# EAGLE design miniKame (EAGLE 7.4.0)
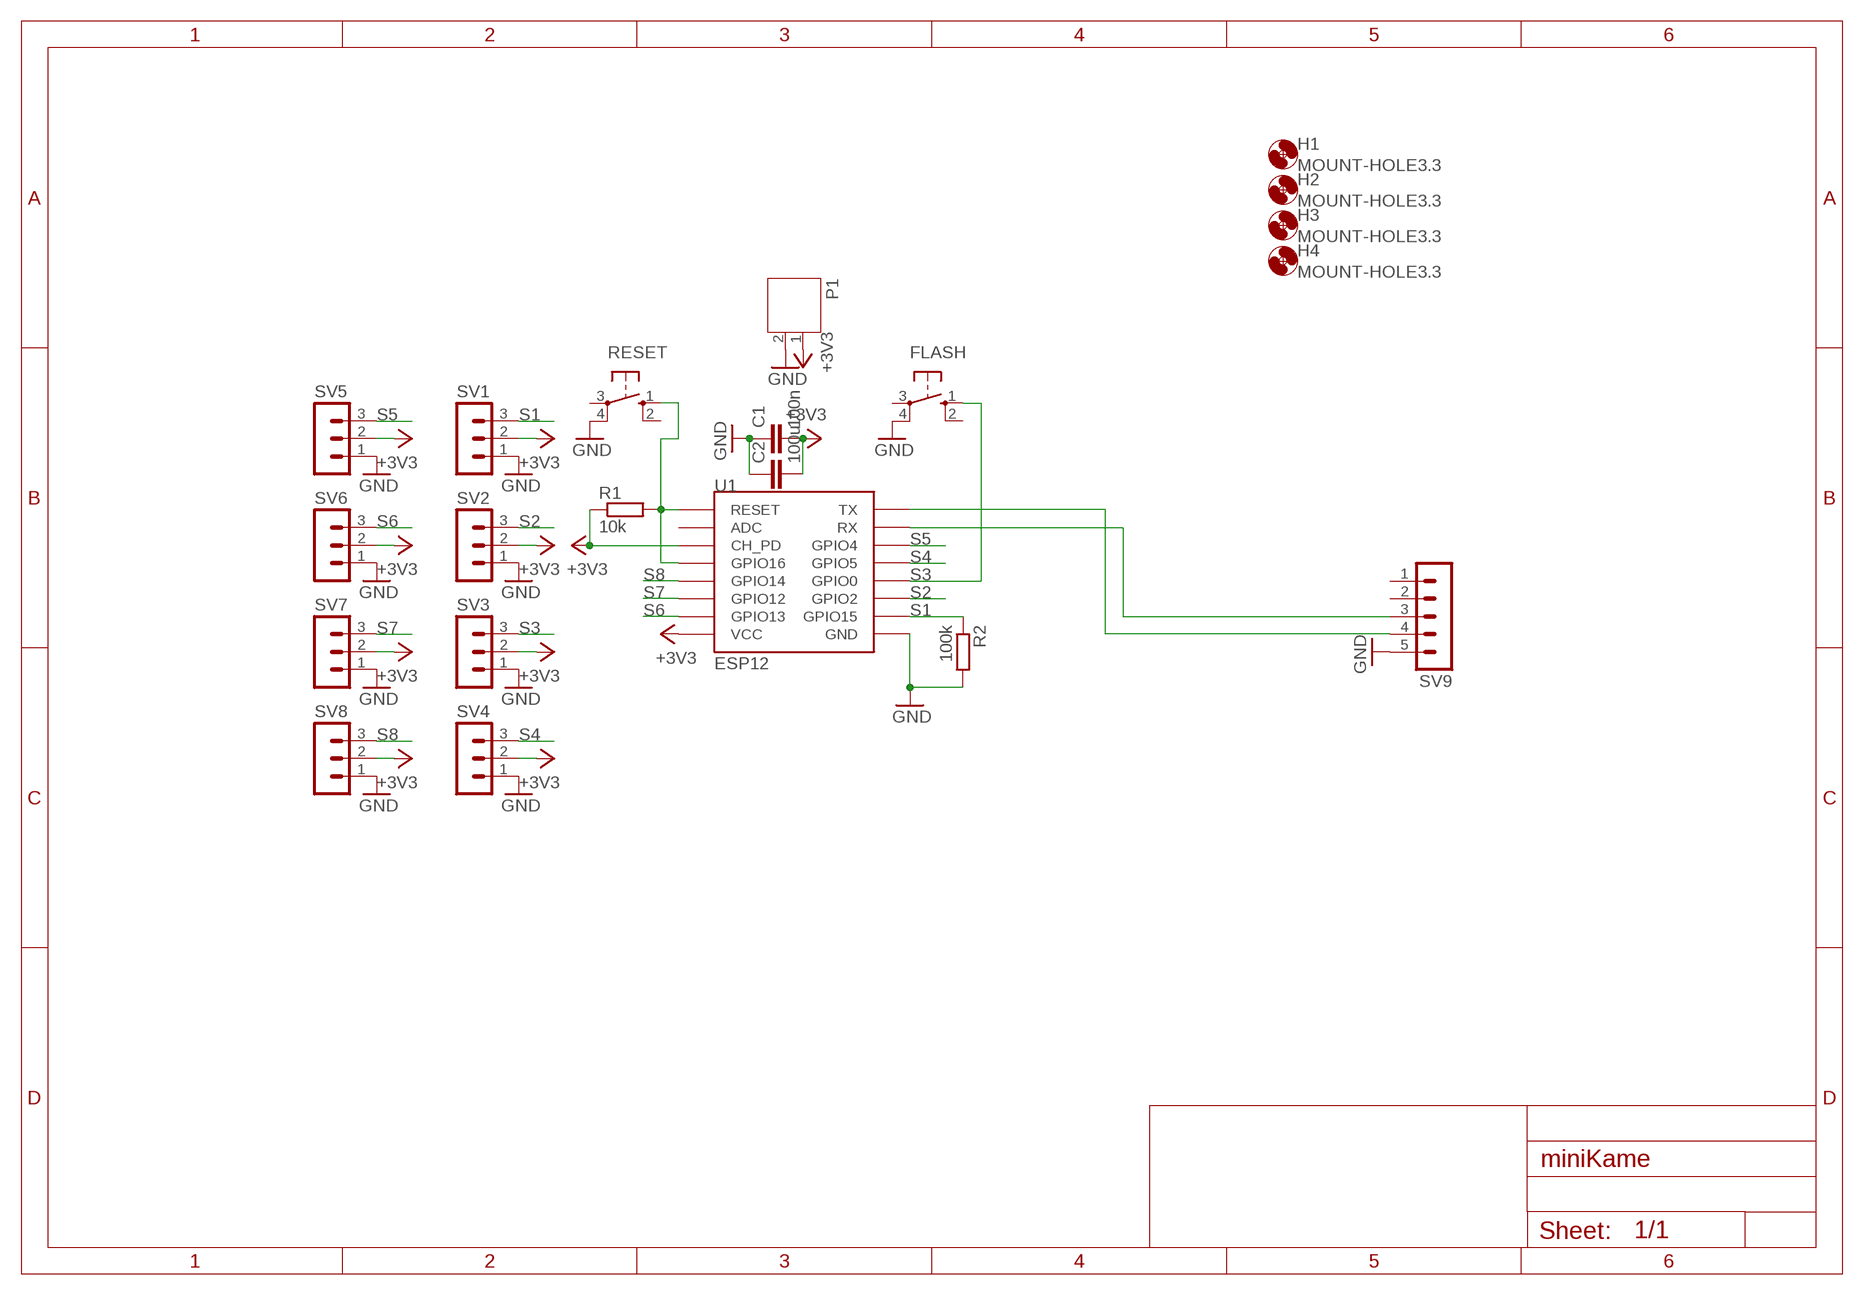
[diagram p0: schematic, sheet 1]

## Parts
C1  100n  C-EUC0805  [C0805]
C2  100u  C-EUC0805  [C0805]
FLASH  10-XX  [B3F-10XX]
H1  MOUNT-HOLE3.3  [3,3]
H2  MOUNT-HOLE3.3  [3,3]
H3  MOUNT-HOLE3.3  [3,3]
H4  MOUNT-HOLE3.3  [3,3]
P1  JST-PH2  [JST-PH2]
R1  10k  R-EU_M0805  [M0805]
R2  100k  R-EU_M0805  [M0805]
RESET  10-XX  [B3F-10XX]
SV1  MA03-1  [MA03-1]
SV2  MA03-1  [MA03-1]
SV3  MA03-1  [MA03-1]
SV4  MA03-1  [MA03-1]
SV5  MA03-1  [MA03-1]
SV6  MA03-1  [MA03-1]
SV7  MA03-1  [MA03-1]
SV8  MA03-1  [MA03-1]
SV9  MA05-1  [MA05-1]
U1  ESP12  [ESP12]

## Nets
+3V3: C1.2 C2.2 P1.1 R1.1 SV1.2 SV2.2 SV3.2 SV4.2 SV5.2 SV6.2 SV7.2 SV8.2 U1.CH_PD U1.VCC
GND: C1.1 C2.1 FLASH.4(P1) P1.2 R2.2 RESET.4(P1) SV1.1 SV2.1 SV3.1 SV4.1 SV5.1 SV6.1 SV7.1 SV8.1 SV9.5 U1.GND
N$1: SV9.4 U1.TX
N$2: SV9.3 U1.RX
N$4: R1.2 RESET.1(S) U1.GPIO16 U1.RESET
S1: R2.1 SV1.3 U1.GPIO15
S2: SV2.3 U1.GPIO2
S3: FLASH.1(S) SV3.3 U1.GPIO0
S4: SV4.3 U1.GPIO5
S5: SV5.3 U1.GPIO4
S6: SV6.3 U1.GPIO13
S7: SV7.3 U1.GPIO12
S8: SV8.3 U1.GPIO14
Unconnected: FLASH.2(S1) FLASH.3(P) RESET.2(S1) RESET.3(P) SV9.1 SV9.2 U1.ADC

## Library data of the parts
C1 C2 = resistor:C-EU: CAPACITOR, European symbol
FLASH RESET = switch-omron:10-XX: OMRON SWITCH; MPN: B3F-1000; OC_FARNELL: 176432; OC_NEWARK: 36M3542
H1-H4 = holes:MOUNT-HOLE: MOUNTING HOLE with drill center marker
P1 = jst-ph:JST-PH2
R1 R2 = resistor:R-EU_: RESISTOR, European symbol
SV1-SV8 = con-lstb:MA03-1: PIN HEADER; OC_FARNELL: unknown; OC_NEWARK: unknown
SV9 = con-lstb:MA05-1: PIN HEADER; OC_FARNELL: unknown; OC_NEWARK: unknown
U1 = esp8266modules:ESP12: ESP8266 Wifi module 12

## Board
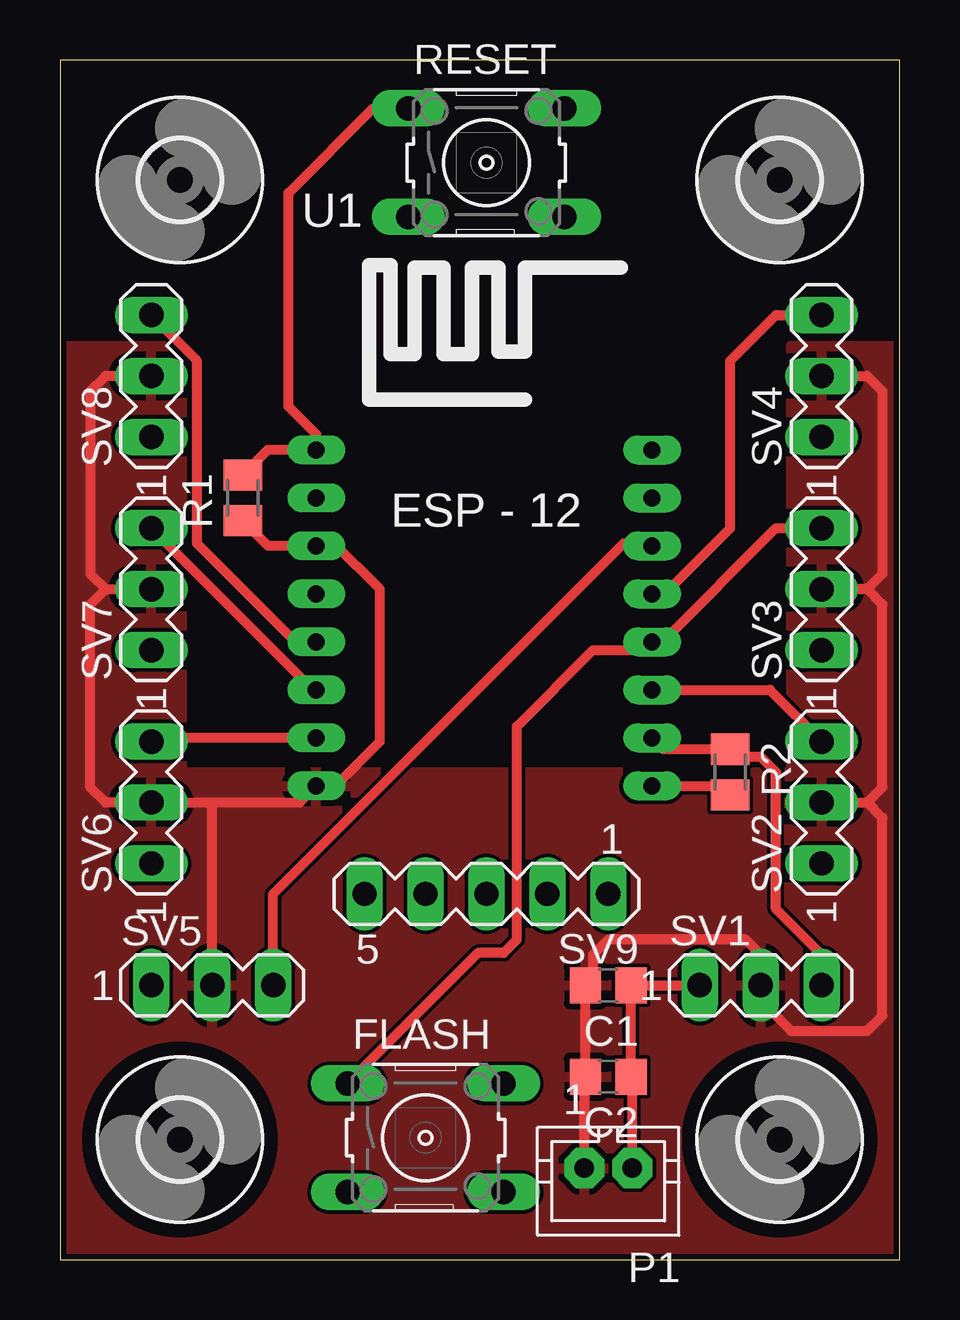
[diagram p1: board, top side]
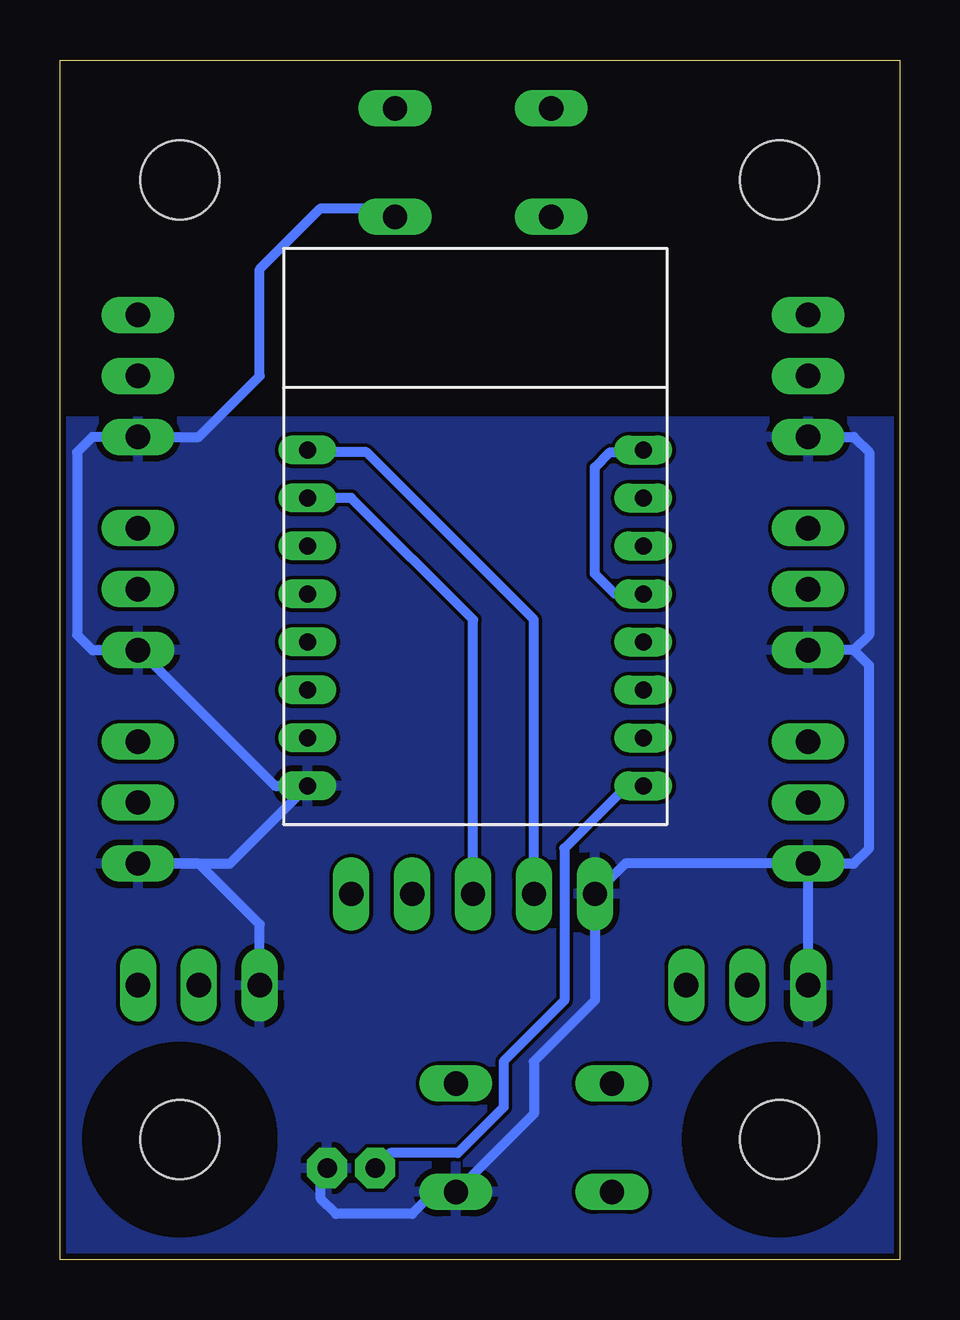
[diagram p2: board, bottom side, seen from below]

Size 35 x 50 mm. Coordinates in mm from the lower left corner, seen from the top.
Outline: 0,0 35,0 35,50 0,50 0,0
Copper layers (1*16): Top 0.035mm / dielectric 1.5mm / Bottom 0.035mm
Design rules "Elecrow_2-layer_eagle_rule": minimum track width 6mil, minimum drill 12mil, track to track 6mil, track to pad 6mil, pad to pad 6mil, via to via 6mil, smd to smd 0mil, copper to edge 10mil, drill to drill 10mil, minimum pad ring 10mil, minimum via ring 6mil, stop-mask expansion 2mil, vias tented up to drill 100mil, thermal gap 10mil

### Footprints (pad centres in the part's own frame; a part is rotated, then mirrored left to right if it is on the bottom)
C0805 = smd 1.3 x 1.5: 1 -0.95,0; 2 0.95,0
B3F-10XX = drill 1.016 long: 1 -3.251,2.261; 2 3.251,2.261; 3 -3.251,-2.261; 4 3.251,-2.261
3,3 = hole 3.3: 0,0
JST-PH2 = drill 0.813 pad 1.676 octagon: 1 1,0; 2 -1,0
M0805 = smd 1.3 x 1.6: 1 -0.95,0; 2 0.95,0
MA03-1 = drill 1.016 long: 1 -2.54,0; 2 0,0; 3 2.54,0
MA05-1 = drill 1.016 long: 1 -5.08,0; 2 -2.54,0; 3 0,0; 4 2.54,0; 5 5.08,0
ESP12 = drill 0.7 long: ADC -7.1,3.8; CH_PD -7.1,1.8; GND 6.9,-8.2; GPIO0 6.9,-2.2; GPIO2 6.9,-4.2; GPIO4 6.9,1.8; GPIO5 6.9,-0.2; GPIO12 -7.1,-4.2; GPIO13 -7.1,-6.2; GPIO14 -7.1,-2.2; GPIO15 6.9,-6.2; GPIO16 -7.1,-0.2; RESET -7.1,5.8; RX 6.9,3.8; TX 6.9,5.8; VCC -7.1,-8.2

### Placement (x,y rotation side)
C1  22.86,11.43 180 top
C2  22.86,7.62 180 top
FLASH  15.24,5.08 0 top
H1  5,5 0 top
H2  30,5 0 top
H3  5,45 0 top
H4  30,45 0 top
P1  22.86,3.81 180 top
R1  7.62,31.75 90 top
R2  27.94,20.32 270 top
RESET  17.78,45.72 0 top
SV1  29.21,11.43 0 top
SV2  31.75,19.05 90 top
SV3  31.75,27.94 90 top
SV4  31.75,36.83 90 top
SV5  6.35,11.43 0 top
SV6  3.81,19.05 90 top
SV7  3.81,27.94 90 top
SV8  3.81,36.83 90 top
SV9  17.78,15.24 180 top
U1  17.78,27.94 0 top

### Tracks (layer width: path | path; a pad name or v marks a point on that pad's centre or on a via)
+3V3
  Top 0.406: R1.1 8.68,29.74 U1.CH_PD 10.79,29.84 11.43,29.84 13.34,27.94 13.34,21.59 11.48,19.74 U1.VCC 9.99,19.05 6.35,19.05 | P1.1 21.86,7.57 C2.2 C1.2 22.23,11.74 22.23,12.7 22.86,13.34 28.57,13.34 29.21,12.7 SV1.2 29.21,10.79 30.48,9.53 33.66,9.53 34.29,10.16 34.29,18.41 33.66,19.05 | SV4.2 33.66,36.83 34.29,36.2 34.29,28.57 33.66,27.94 | 33.66,27.94 SV3.2 | SV2.2 33.66,19.05 | 33.66,19.05 34.29,19.68 34.29,27.3 33.66,27.94 | 6.35,19.05 SV6.2 1.91,19.05 1.27,19.68 1.27,27.3 1.91,27.94 | SV8.2 1.91,36.83 1.27,36.2 1.27,28.57 1.91,27.94 | 1.91,27.94 SV7.2 | SV5.2 6.35,19.05
  Bottom 0.406: U1.VCC 11.38,19.74 13.97,17.14 13.97,10.79 16.51,8.26 16.51,6.35 18.41,4.45 21.23,4.45 P1.1
  pour Top: 0,38.1 5.08,38.1 5.08,20.32 30.48,20.32 30.48,38.1 34.92,38.1 34.92,0 0,0
GND
  Top 0.406: U1.GND 27.57,19.74 R2.2 | P1.2 23.86,7.57 C2.1 C1.1 SV1.1
  Bottom 0.406: SV8.1 1.91,34.29 1.27,33.66 1.27,26.04 1.91,25.4 | 1.91,25.4 SV7.1 | SV6.1 1.91,16.51 1.27,17.14 1.27,24.77 1.91,25.4 | SV5.1 SV6.1 | SV6.1 11.43,16.51 SV9.5 12.7,10.79 15.24,8.26 15.24,6.07 FLASH.4 19.41,2.82 20.32,1.91 23.5,1.91 24.13,2.54 24.13,3.54 P1.2 | SV1.1 26.67,13.97 29.21,16.51 SV2.1 27.91,16.51 U1.GND 26.04,19.74 31.7,25.4 SV3.1 33.66,25.4 34.29,26.04 34.29,33.66 33.66,34.29 SV4.1 29.21,34.29 26.67,36.83 26.67,41.27 24.13,43.81 21.39,43.81 RESET.4
  pour Bottom: 0,34.92 34.92,34.92 34.92,0 0,0
N$1
  Bottom 0.406: SV9.4 15.24,26.67 22.23,33.66 24.59,33.66 U1.TX
N$2
  Bottom 0.406: SV9.3 17.78,26.67 22.86,31.75 U1.RX
N$4
  Top 0.406: R1.2 8.66,33.74 U1.RESET 10.68,34.41 9.53,35.56 9.53,44.45 13.06,47.98 RESET.1
  Bottom 0.406: U1.GPIO16 11.87,27.74 12.7,28.57 12.7,33.02 12.06,33.66 10.77,33.66 U1.RESET
S1
  Top 0.406: SV1.3 31.75,12.7 29.84,14.61 29.84,20.32 29.21,20.95 28.25,20.95 R2.1 25.15,21.27 U1.GPIO15
S2
  Top 0.406: U1.GPIO2 29.6,23.74 SV2.3
S3
  Top 0.406: SV3.3 29.84,30.48 25.11,25.74 U1.GPIO0 24.34,25.4 22.23,25.4 19.05,22.23 19.05,13.34 18.49,12.78 17.42,12.78 FLASH.1
S4
  Top 0.406: U1.GPIO5 25.2,27.74 27.94,30.48 27.94,37.47 29.84,39.37 SV4.3
S5
  Top 0.406: SV5.3 8.89,15.24 23.5,29.84 24.57,29.84 U1.GPIO4
S6
  Top 0.406: U1.GPIO13 3.96,21.74 SV6.3
S7
  Top 0.406: U1.GPIO12 10.55,23.74 SV7.3
S8
  Top 0.406: U1.GPIO14 9.82,25.74 5.71,29.84 5.71,37.47 SV8.3